# Altium schematic sheet IMU.SchDoc: IMU
size A3; DrawnBy: Hank Wu, Connor Kwon; Address1: ECE Department; Address2: University of Canterbury; Address3: Christchurch 8041; Address4: New Zealand; Revision: 1
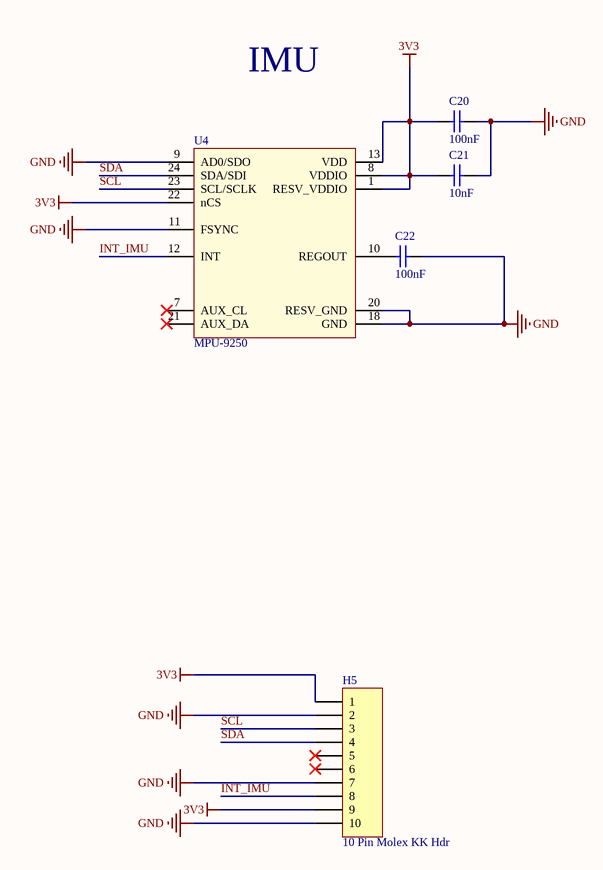
[diagram p0: IMU.SchDoc]

## Parts
C20  100nF  [CAPC1608L]
C21  10nF  [CAPC1608L]
C22  100nF  [CAPC1608L]
H5  10 Pin Molex KK Hdr  [MOLEX_KK_10_HDR]
U4  MPU-9250  [Quad24]

## Nets
3V3: C20.1 C21.1 H5.1 H5.9 U4.1(RESV_VDDIO) U4.8(VDDIO) U4.13(VDD) U4.22(nCS)
GND: C20.2 C21.2 C22.2 H5.2 H5.7 H5.10 U4.9(AD0/SDO) U4.11(FSYNC) U4.18(GND) U4.20(RESV_GND)
INT_IMU: H5.8 U4.12(INT)
SCL: H5.3 U4.23(SCL/SCLK)
SDA: H5.4 U4.24(SDA/SDI)
NetC22_1: C22.1 U4.10(REGOUT)

Not connected (* = marked no-connect by the designer): H5 5* 6*; U4 7(AUX_CL)* 21(AUX_DA)*

## Notes on the sheet
- IMU
- Title
- Drawn by:
- Date:
- Time:
- Revision:
- Sheet
- of
- File:

## Library data of the parts
C20 C22 = CC_100nF_0603: CAP CER 100nF X7R +-10% 50V 0603; PackageReference: 0603; Code_IPC: 1608 [0603]; Verify: *; Supplier: ECE Dept; Storage Location: PCB Assembly WS; Value: 100nF
C21 = CC_10nF_0603: CAP CER 10nF X7R +-10% 50V 0603; PackageReference: 0603; Code_IPC: 1608 [0603]; Verify: *; Supplier: ECE Dept; Storage Location: PCB Assembly WS; Value: 10nF
H5 = JA_MOLEX_KK_10POS: CONN HEADER 10POS 2.54mm VERT_ Thru Hole; Supplier 1: Farnell; Supplier Part Number 1: 1756828; Supplier: ECE Dept; Storage Location: ECE Dept Store; Value: 10 Pin Molex KK Hdr
U4 = MPU-9250: 9 axis IMU